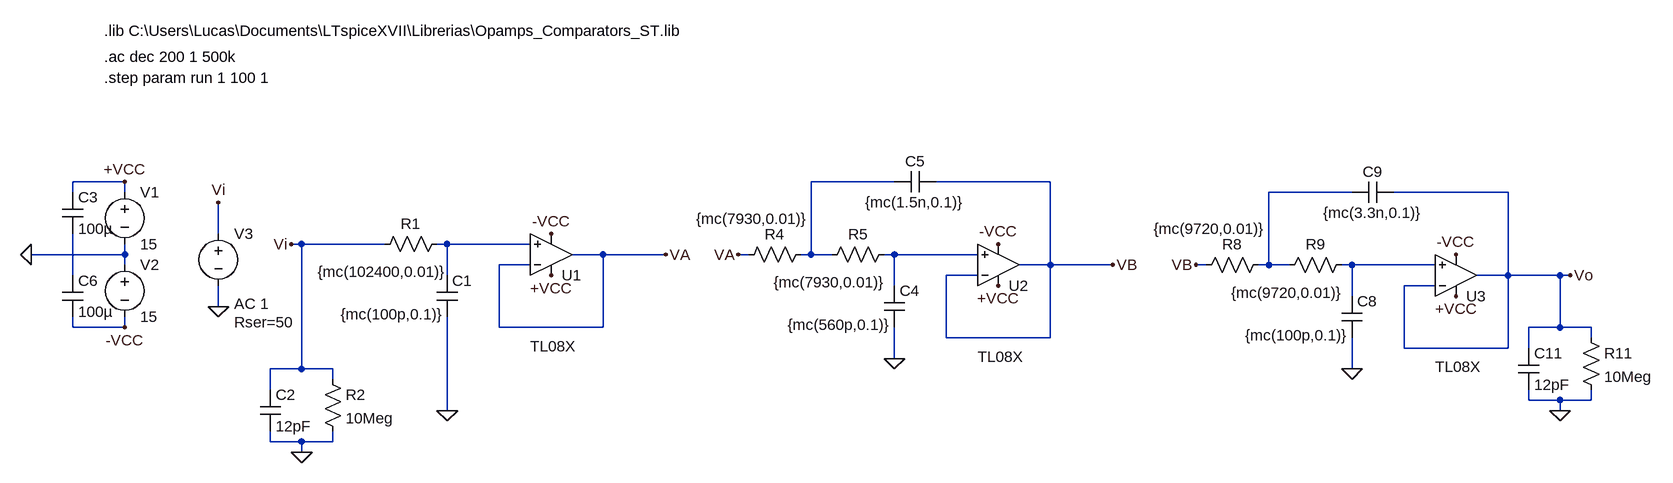
[diagram p0: schematic ConexionCascadaLegendre.asc]
ConexionCascadaLegendre.asc, the LTspice schematic file:
Version 4
SHEET 1 2928 680
WIRE -352 -128 -432 -128
WIRE 832 -128 704 -128
WIRE 1072 -128 896 -128
WIRE -432 -112 -432 -128
WIRE -352 -112 -352 -128
WIRE 1536 -112 1408 -112
WIRE 1776 -112 1600 -112
WIRE -208 -48 -208 -96
WIRE -80 -32 -96 -32
WIRE 48 -32 -80 -32
WIRE 144 -32 128 -32
WIRE 272 -32 144 -32
WIRE -352 -16 -352 -32
WIRE -352 -16 -496 -16
WIRE 384 -16 336 -16
WIRE 480 -16 384 -16
WIRE 608 -16 592 -16
WIRE 704 -16 704 -128
WIRE 704 -16 688 -16
WIRE 736 -16 704 -16
WIRE 832 -16 816 -16
WIRE 960 -16 832 -16
WIRE -352 0 -352 -16
WIRE 272 0 224 0
WIRE 1072 0 1072 -128
WIRE 1072 0 1024 0
WIRE 1168 0 1072 0
WIRE 1312 0 1296 0
WIRE 1408 0 1408 -112
WIRE 1408 0 1392 0
WIRE 1440 0 1408 0
WIRE 1536 0 1520 0
WIRE 1664 0 1536 0
WIRE -432 16 -432 -48
WIRE 144 16 144 -32
WIRE 960 16 912 16
WIRE 1776 16 1776 -112
WIRE 1776 16 1728 16
WIRE 1856 16 1776 16
WIRE 1872 16 1856 16
WIRE 832 32 832 -16
WIRE 1664 32 1616 32
WIRE 1536 48 1536 0
WIRE -208 64 -208 32
WIRE -432 96 -432 80
WIRE -352 96 -352 80
WIRE -352 96 -432 96
WIRE 224 96 224 0
WIRE 384 96 384 -16
WIRE 384 96 224 96
WIRE 1856 96 1856 16
WIRE 1856 96 1808 96
WIRE 1904 96 1856 96
WIRE 912 112 912 16
WIRE 1072 112 1072 0
WIRE 1072 112 912 112
WIRE 1904 112 1904 96
WIRE 1616 128 1616 32
WIRE 1776 128 1776 16
WIRE 1776 128 1616 128
WIRE 1808 128 1808 96
WIRE 832 144 832 96
WIRE -80 160 -80 -32
WIRE -80 160 -128 160
WIRE -32 160 -80 160
WIRE 1536 160 1536 112
WIRE -32 176 -32 160
WIRE -128 192 -128 160
WIRE 1808 208 1808 192
WIRE 1856 208 1808 208
WIRE 1904 208 1904 192
WIRE 1904 208 1856 208
WIRE 144 224 144 80
WIRE 1856 224 1856 208
WIRE -128 272 -128 256
WIRE -80 272 -128 272
WIRE -32 272 -32 256
WIRE -32 272 -80 272
WIRE -80 288 -80 272
FLAG -496 -16 0
FLAG -352 -128 +VCC
FLAG -208 64 0
FLAG -208 -96 Vi
FLAG 304 16 +VCC
FLAG 304 -48 -VCC
FLAG 144 224 0
FLAG 480 -16 VA
FLAG -96 -32 Vi
FLAG -80 288 0
FLAG 992 32 +VCC
FLAG 992 -32 -VCC
FLAG 832 144 0
FLAG 1168 0 VB
FLAG 1696 48 +VCC
FLAG 1696 -16 -VCC
FLAG 1536 160 0
FLAG 1872 16 Vo
FLAG 1856 224 0
FLAG 592 -16 VA
FLAG 1296 0 VB
FLAG -352 96 -VCC
SYMBOL Opamps\\opamp2 304 48 M180
WINDOW 3 -32 -77 Left 2
SYMATTR Value TL08X
SYMATTR InstName U1
SYMBOL voltage -352 -128 R0
WINDOW 123 0 0 Left 0
WINDOW 39 0 0 Left 0
SYMATTR InstName V1
SYMATTR Value 15
SYMBOL voltage -352 -16 R0
WINDOW 123 0 0 Left 0
WINDOW 39 0 0 Left 0
SYMATTR InstName V2
SYMATTR Value 15
SYMBOL voltage -208 -64 R0
WINDOW 123 24 124 Left 2
WINDOW 39 24 152 Left 2
SYMATTR Value2 AC 1
SYMATTR SpiceLine Rser=50
SYMATTR InstName V3
SYMATTR Value ""
SYMBOL res 144 -48 R90
WINDOW 0 0 56 VBottom 2
WINDOW 3 43 99 VTop 2
SYMATTR InstName R1
SYMATTR Value {mc(102400,0.01)}
SYMBOL cap 128 16 R0
WINDOW 3 -148 60 Left 2
SYMATTR Value {mc(100p,0.1)}
SYMATTR InstName C1
SYMBOL cap -144 192 R0
SYMATTR InstName C2
SYMATTR Value 12pF
SYMBOL res -48 160 R0
SYMATTR InstName R2
SYMATTR Value 10Meg
SYMBOL Opamps\\opamp2 992 64 M180
WINDOW 3 -32 -77 Left 2
SYMATTR Value TL08X
SYMATTR InstName U2
SYMBOL res 704 -32 R90
WINDOW 0 0 56 VBottom 2
WINDOW 3 -55 90 VTop 2
SYMATTR InstName R4
SYMATTR Value {mc(7930,0.01)}
SYMBOL res 832 -32 R90
WINDOW 0 0 56 VBottom 2
WINDOW 3 43 99 VTop 2
SYMATTR InstName R5
SYMATTR Value {mc(7930,0.01)}
SYMBOL cap 816 32 R0
WINDOW 3 -148 60 Left 2
SYMATTR Value {mc(560p,0.1)}
SYMATTR InstName C4
SYMBOL cap 896 -144 R90
WINDOW 0 0 32 VBottom 2
WINDOW 3 32 32 VTop 2
SYMATTR InstName C5
SYMATTR Value {mc(1.5n,0.1)}
SYMBOL Opamps\\opamp2 1696 80 M180
WINDOW 3 -32 -77 Left 2
SYMATTR Value TL08X
SYMATTR InstName U3
SYMBOL res 1408 -16 R90
WINDOW 0 0 56 VBottom 2
WINDOW 3 -55 90 VTop 2
SYMATTR InstName R8
SYMATTR Value {mc(9720,0.01)}
SYMBOL res 1536 -16 R90
WINDOW 0 0 56 VBottom 2
WINDOW 3 43 99 VTop 2
SYMATTR InstName R9
SYMATTR Value {mc(9720,0.01)}
SYMBOL cap 1520 48 R0
WINDOW 3 -148 60 Left 2
SYMATTR Value {mc(100p,0.1)}
SYMATTR InstName C8
SYMBOL cap 1600 -128 R90
WINDOW 0 0 32 VBottom 2
WINDOW 3 32 32 VTop 2
SYMATTR InstName C9
SYMATTR Value {mc(3.3n,0.1)}
SYMBOL cap 1792 128 R0
SYMATTR InstName C11
SYMATTR Value 12pF
SYMBOL res 1888 96 R0
SYMATTR InstName R11
SYMATTR Value 10Meg
SYMBOL cap -448 -112 R0
SYMATTR InstName C3
SYMATTR Value 100µ
SYMBOL cap -448 16 R0
SYMATTR InstName C6
SYMATTR Value 100µ
TEXT -384 -360 Left 2 !.lib C:\\Users\\Lucas\\Documents\\LTspiceXVII\\Librerias\\Opamps_Comparators_ST.lib
TEXT -384 -320 Left 2 !.ac dec 200 1 500k
TEXT -384 -288 Left 2 !.step param run 1 100 1

The netlist it stands for:
* ConexionCascadaLegendre.asc
XU1 N003 VA +VCC -VCC VA TL08X  ; pins In+ In- V+ V- OUT
V1 +VCC 0 15
V2 0 -VCC 15
V3 Vi 0 AC 1 Rser=50
R1 N003 Vi {mc(102400,0.01)}
C1 N003 0 {mc(100p,0.1)}
C2 Vi 0 12pF
R2 Vi 0 10Meg
XU2 N004 VB +VCC -VCC VB TL08X  ; pins In+ In- V+ V- OUT
R4 N001 VA {mc(7930,0.01)}
R5 N004 N001 {mc(7930,0.01)}
C4 N004 0 {mc(560p,0.1)}
C5 VB N001 {mc(1.5n,0.1)}
XU3 N005 Vo +VCC -VCC Vo TL08X  ; pins In+ In- V+ V- OUT
R8 N002 VB {mc(9720,0.01)}
R9 N005 N002 {mc(9720,0.01)}
C8 N005 0 {mc(100p,0.1)}
C9 Vo N002 {mc(3.3n,0.1)}
C11 Vo 0 12pF
R11 Vo 0 10Meg
C3 +VCC N006 100µ
C6 N006 -VCC 100µ
.lib C:\Users\Lucas\Documents\LTspiceXVII\Librerias\Opamps_Comparators_ST.lib
.ac dec 200 1 500k
.step param run 1 100 1
.backanno
.end